# EasyEDA Pro project Main.eprj, schematic Schematic1
Board Name: LED; Create Date: 2026-03-09; Page Name: P1; Project Name: Main; Schematic Name: Schematic1; Update Date: 2026-03-08; Company: EasyEDA.com; Page Size: A4; Version: V1.0
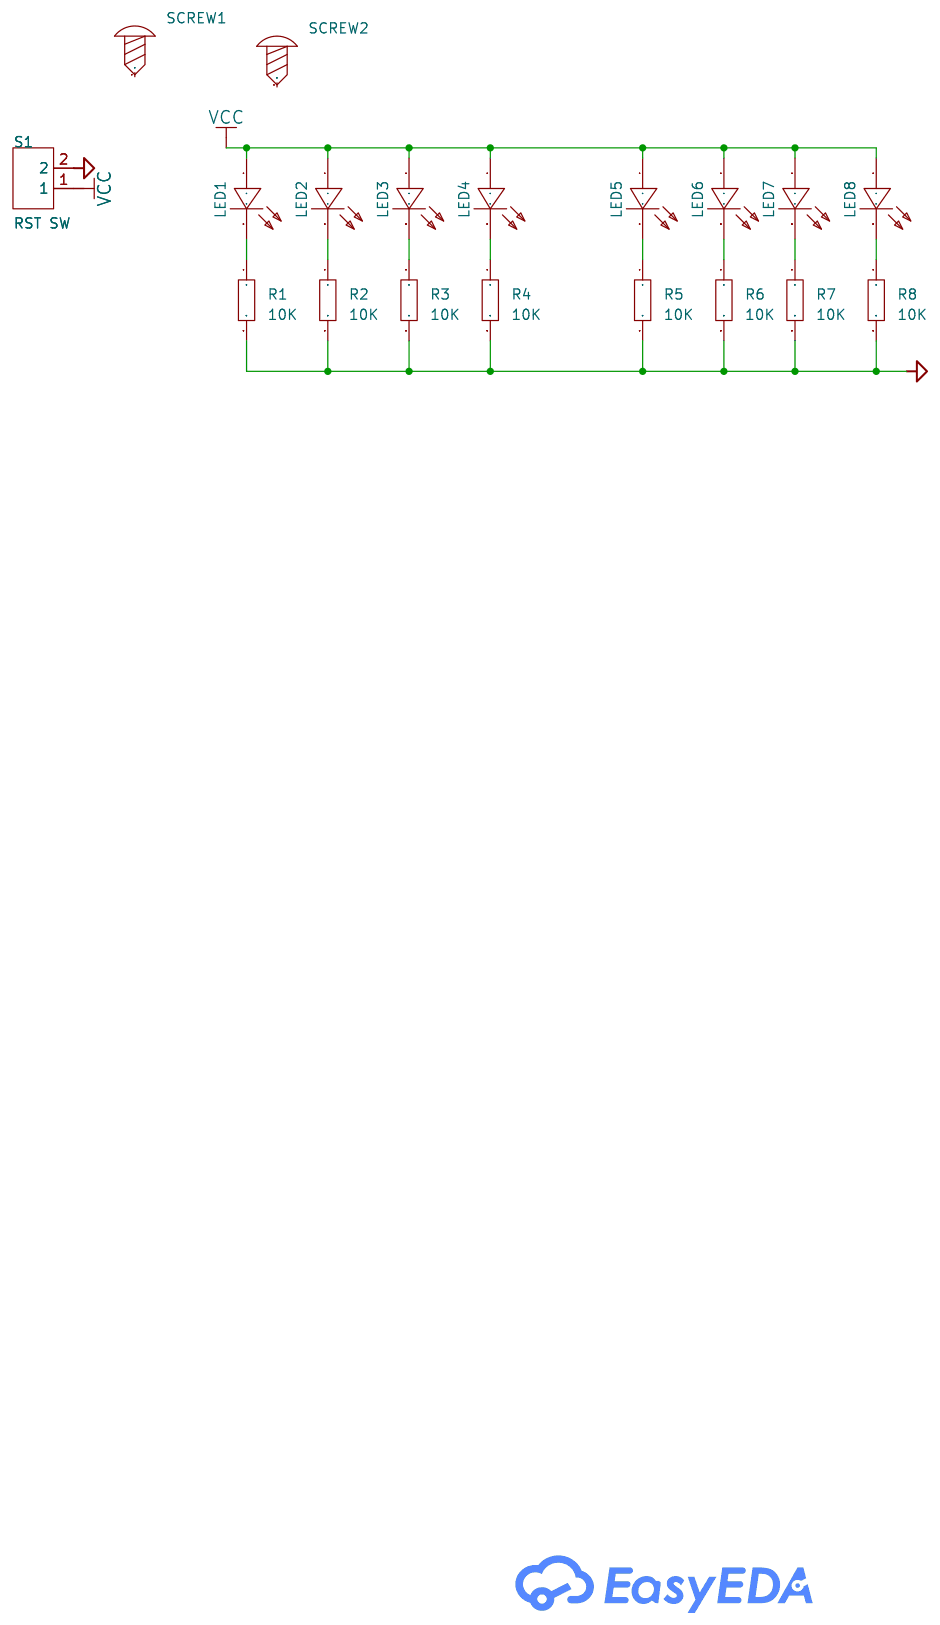
[diagram p7: schematic sheet]

## Parts
LED1  3528W  [LED-SMD_L3.6-W2.9-R-RD]
LED2  3528W  [LED-SMD_L3.6-W2.9-R-RD]
LED3  3528W  [LED-SMD_L3.6-W2.9-R-RD]
LED4  3528W  [LED-SMD_L3.6-W2.9-R-RD]
LED5  3528W  [LED-SMD_L3.6-W2.9-R-RD]
LED6  3528W  [LED-SMD_L3.6-W2.9-R-RD]
LED7  3528W  [LED-SMD_L3.6-W2.9-R-RD]
LED8  3528W  [LED-SMD_L3.6-W2.9-R-RD]
R1  10K  [R0603]
R2  10K  [R0603]
R3  10K  [R0603]
R4  10K  [R0603]
R5  10K  [R0603]
R6  10K  [R0603]
R7  10K  [R0603]
R8  10K  [R0603]
S1  RST SW  [CONN-TH_2P-P2.50_CNJM_CNJMA2501WR-2P]
SCREW1  -  [Screw-Hole-M2]
SCREW2  -  [Screw-Hole-M2]

## Library data of the parts
LED1-LED8 = 3528W_C26545: LCSC Part Name: 暖白 3528 LED灯珠; Supplier Part: C26545; Manufacturer: KENTO; Supplier Footprint: SMD3528-2P; JLCPCB Part Class: Extended Part; Datasheet: https://item.szlcsc.com/datasheet/3528W/27290.html; Supplier: LCSC; Illumination Color: Cold White; Voltage - Forward(Vf): 3.4V; Power(Watts): 64mW; Forward Current: 20mA; Diode Configuration: Discrete Diode; Color Temperature: 6500K; Viewing Angle: 110°; Mounting Style: op View Mount; Operating Temperature: -40℃~+85℃
R1-R8 = Res_0603: Supplier Footprint: 0603
S1 = ZX-XH2.54-2PZZ: Pins Structure:1x2P Pitch:2.5mm Mounting Type:Through Hole Reference Series:XH Number of Pins:2P Number of Rows:1 Number of PINs Per Row:2 Row Spacing:- Current Rating:2A Contact Material:Brass Contact Plating:Tin Operating Temperature:-25℃~+85℃ Operating; LCSC Part Name: 1x2P 间距:2.5mm 直插 系列:XH; Supplier Part: C7429632; Manufacturer: Megastar(兆星); Supplier Footprint: 插件,P=2.5mm; JLCPCB Part Class: Extended Part; Datasheet: https://item.szlcsc.com/datasheet/ZX-XH2.54-2PZZ/8427549.html; Supplier: LCSC; Pins Structure: 1x2P; Pitch: 2.5mm; Mounting Type: Through Hole; Reference Series: XH; Number of Pins: 2P; Number of Rows: 1; Number of PINs Per Row: 2; Current Rating: 2A; Contact Material: Brass; Contact Plating: Tin; Operating Temperature: -25℃~+85℃; Voltage Rating: 250V; Plastic Material: PA66; Flame Retardant Rating: UL94V-0; Color: White; Z-Height of the Board: 7mm; X-Length of Bottom Edge on Board (Spacing Line): 7.5mm; Y-Width of Bottom Edge on Board: 5.9mm
SCREW1 SCREW2 = Screw-Hole-M2: Supplier Footprint: 插件

## Nets
VCC: LED1.1(A) LED2.1(A) LED3.1(A) LED4.1(A) LED5.1(A) LED6.1(A) LED7.1(A) LED8.1(A) S1.1
POWER_GND: R1.2 R2.2 R3.2 R4.2 R5.2 R6.2 R7.2 R8.2 S1.2
$1N1822: LED1.2(K) R1.1
$1N1824: LED2.2(K) R2.1
$1N1826: LED3.2(K) R3.1
$1N1828: LED4.2(K) R4.1
$1N1830: LED5.2(K) R5.1
$1N1832: LED6.2(K) R6.1
$1N1834: LED7.2(K) R7.1
$1N1836: LED8.2(K) R8.1

Not connected (* = marked no-connect by the designer): SCREW1 1; SCREW2 1
